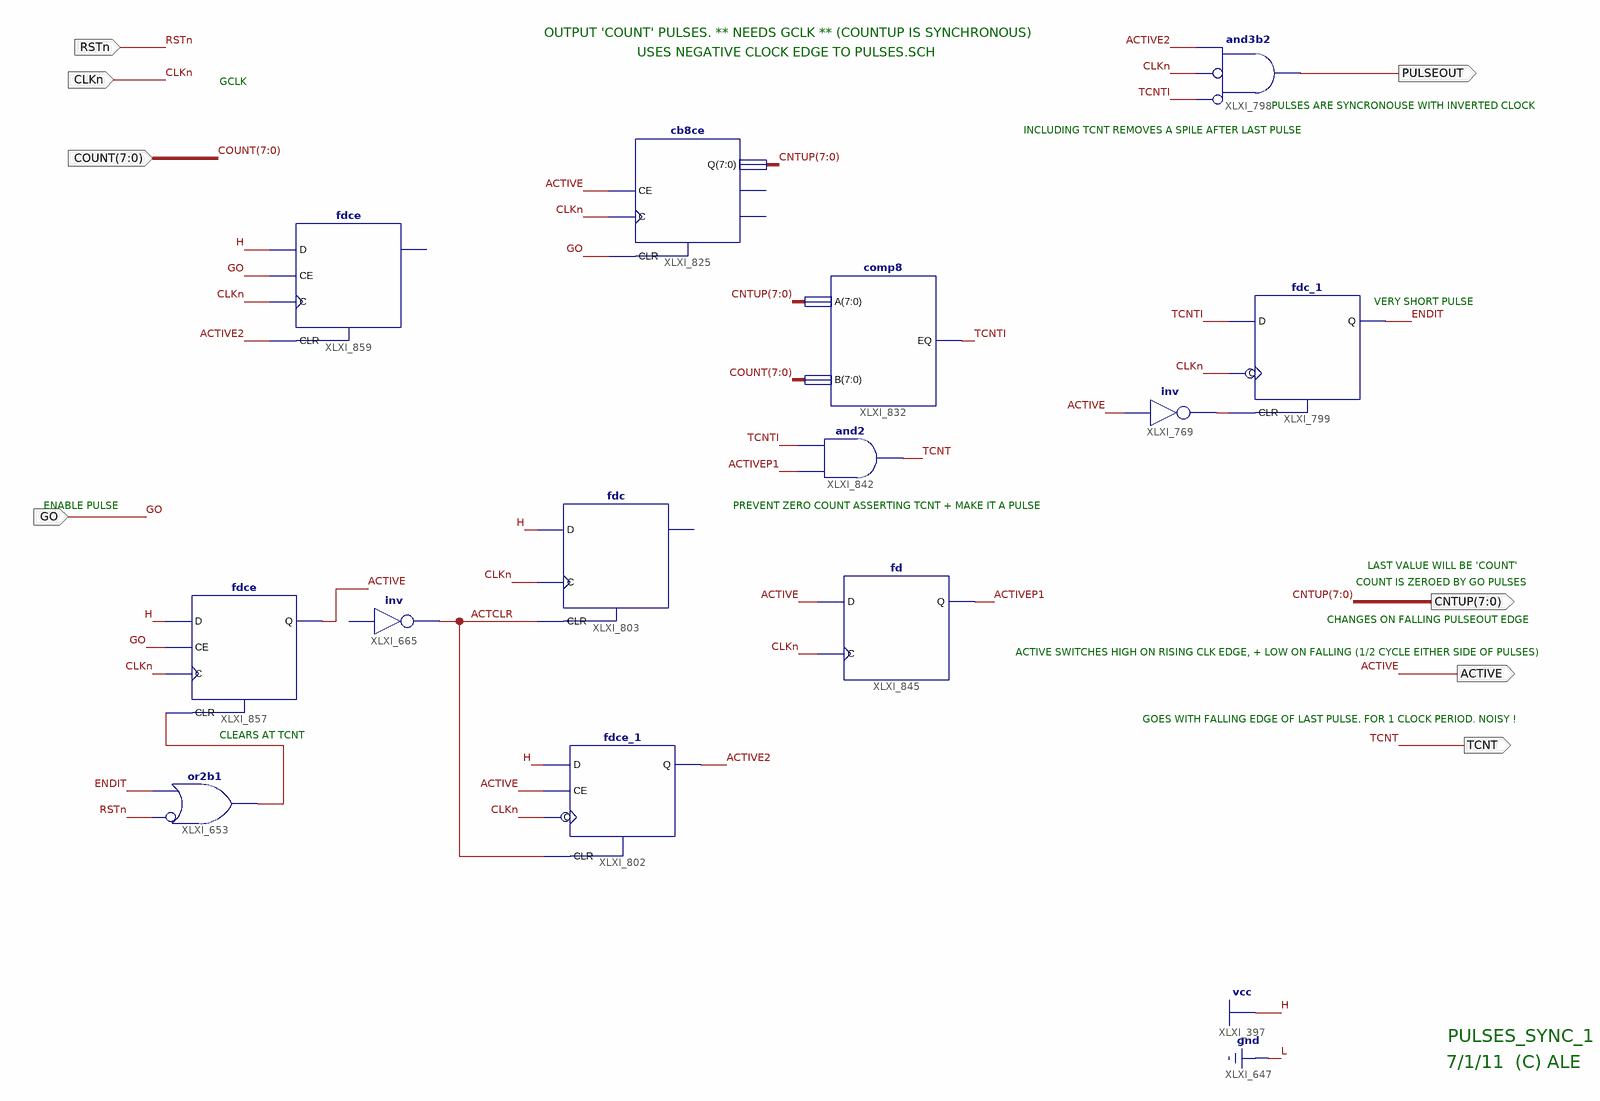
[diagram p0: schematic sheet 1]
// Xilinx ISE schematic Pulses_Sync_1.sch (spartan3e) as structural Verilog: 13 symbols, 8 ports
module Pulses_Sync_1 (
  input  RSTn,
  input  CLKn,
  input  [7:0] COUNT,
  input  GO,
  output ACTIVE,
  output TCNT,
  output PULSEOUT,
  output [7:0] CNTUP
);

  wire ACTCLR, ACTIVE2, ACTIVEP1, ENDIT, TCNTI, XLXN_122, XLXN_241;

  and XLXI_798 (PULSEOUT, ~TCNTI, ~CLKn, ACTIVE2);  // and3b2
  cb8ce XLXI_825 (.C(CLKn), .CE(ACTIVE), .CLR(GO), .Q(CNTUP));  // open: CEO, TC
  comp8 XLXI_832 (.A(CNTUP), .B(COUNT), .EQ(TCNTI));
  not XLXI_769 (XLXN_241, ACTIVE);
  fdc_1 XLXI_799 (.C(CLKn), .CLR(XLXN_241), .D(TCNTI), .Q(ENDIT));
  and XLXI_842 (TCNT, ACTIVEP1, TCNTI);
  // inv XLXI_665 has open pins: I=open, O=ACTCLR
  or XLXI_653 (XLXN_122, ~RSTn, ENDIT);  // or2b1
  fd XLXI_845 (.C(CLKn), .D(ACTIVE), .Q(ACTIVEP1));
  fdce_1 XLXI_802 (.C(CLKn), .CE(ACTIVE), .CLR(ACTCLR), .D(1'b1), .Q(ACTIVE2));
  fdc XLXI_803 (.C(CLKn), .CLR(ACTCLR), .D(1'b1));  // open: Q
  fdce XLXI_857 (.C(CLKn), .CE(GO), .CLR(XLXN_122), .D(1'b1), .Q(ACTIVE));
  fdce XLXI_859 (.C(CLKn), .CE(GO), .CLR(ACTIVE2), .D(1'b1));  // open: Q

  // Notes on the sheet:
  //   OUTPUT 'COUNT' PULSES. ** NEEDS GCLK ** (COUNTUP IS SYNCHRONOUS)
  //   USES NEGATIVE CLOCK EDGE TO PULSES.SCH
  //   GCLK
  //   PULSES ARE SYNCRONOUSE WITH INVERTED CLOCK
  //   INCLUDING TCNT REMOVES A SPILE AFTER LAST PULSE
  //   VERY SHORT PULSE
  //   ENABLE PULSE
  //   PREVENT ZERO COUNT ASSERTING TCNT + MAKE IT A PULSE
  //   LAST VALUE WILL BE 'COUNT'
  //   COUNT IS ZEROED BY GO PULSES
  //   CHANGES ON FALLING PULSEOUT EDGE
  //   ACTIVE SWITCHES HIGH ON RISING CLK EDGE, + LOW ON FALLING (1/2 CYCLE EITHER SIDE OF PULSES)
  //   GOES WITH FALLING EDGE OF LAST PULSE. FOR 1 CLOCK PERIOD. NOISY !
  //   CLEARS AT TCNT
  //   PULSES_SYNC_1
  //   7/1/11  (C) ALE
endmodule
